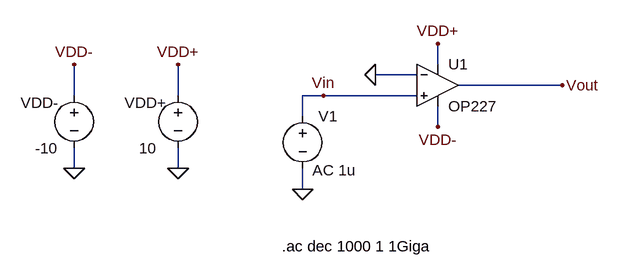
[diagram p0: schematic q1.asc]
q1.asc, the LTspice schematic file:
Version 4.1
SHEET 1 880 680
WIRE 192 128 192 96
WIRE 160 144 96 144
WIRE 384 160 224 160
WIRE -368 176 -368 128
WIRE -208 176 -208 128
WIRE 16 176 -16 176
WIRE 160 176 16 176
WIRE -16 208 -16 176
WIRE 192 224 192 192
WIRE -368 288 -368 256
WIRE -208 288 -208 256
WIRE -16 320 -16 288
FLAG -16 320 0
FLAG 96 144 0
FLAG -368 288 0
FLAG 384 160 Vout
FLAG 16 176 Vin
FLAG -208 288 0
FLAG -368 128 VDD-
FLAG -208 128 VDD+
FLAG 192 96 VDD+
FLAG 192 224 VDD-
SYMBOL voltage -16 192 R0
WINDOW 123 15 99 Left 2
WINDOW 39 0 0 Left 0
SYMATTR Value2 AC 1u
SYMATTR InstName V1
SYMATTR Value ""
SYMBOL voltage -368 160 R0
WINDOW 0 -82 27 Left 2
WINDOW 3 -60 97 Left 2
WINDOW 123 0 0 Left 0
WINDOW 39 0 0 Left 0
SYMATTR InstName VDD-
SYMATTR Value -10
SYMBOL voltage -208 160 R0
WINDOW 0 -82 27 Left 2
WINDOW 3 -60 97 Left 2
WINDOW 123 0 0 Left 0
WINDOW 39 0 0 Left 0
SYMATTR InstName VDD+
SYMATTR Value 10
SYMBOL OpAmps\\OP227 192 96 R0
SYMATTR InstName U1
TEXT -48 408 Left 2 !.ac dec 1000 1 1Giga

The netlist it stands for:
* q1.asc
V1 Vin 0 AC 1u
VDD- VDD- 0 -10
VDD+ VDD+ 0 10
X§U1 Vin 0 VDD+ VDD- Vout OP227  ; pins In+ In- V+ V- OUT
.ac dec 1000 1 1Giga
.backanno
.end

* Results of the author's LTspice run, read from the files saved beside the schematic
* Operating Point, zero values left out:
*   V(vdd-) = -10 V
*   V(vdd+) = 10 V
*   I(VDD+) = -2.718 mA
*   I(VDD-) = 2.718 mA
*   Ix(u1:3) = 2.718 mA
*   Ix(u1:4) = -2.718 mA
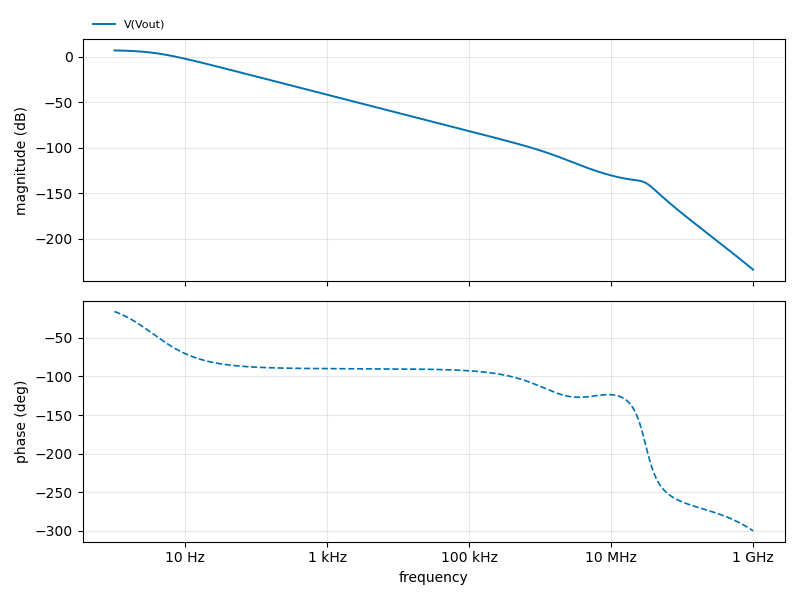
[diagram p1: AC Analysis of q1.asc, plotted from the saved traces]
* AC Analysis, 1 run:
*   V(Vout): 7.06 dB at 1 Hz, -234.07 dB at 1 GHz, peak 7.06 dB at 1 Hz, 3 dB below the peak at 3.796 Hz